# EAGLE schematic PMOD to BeagleWire - CR7CSZ (EAGLE 9.1.3)
LICENSE: CC BY-SA 4.0; REV: CR7CSZ; TITLE: PMOD to BeagleWire Adapter; URL: https://github.com/CapableRobot/PMOD-Adapters
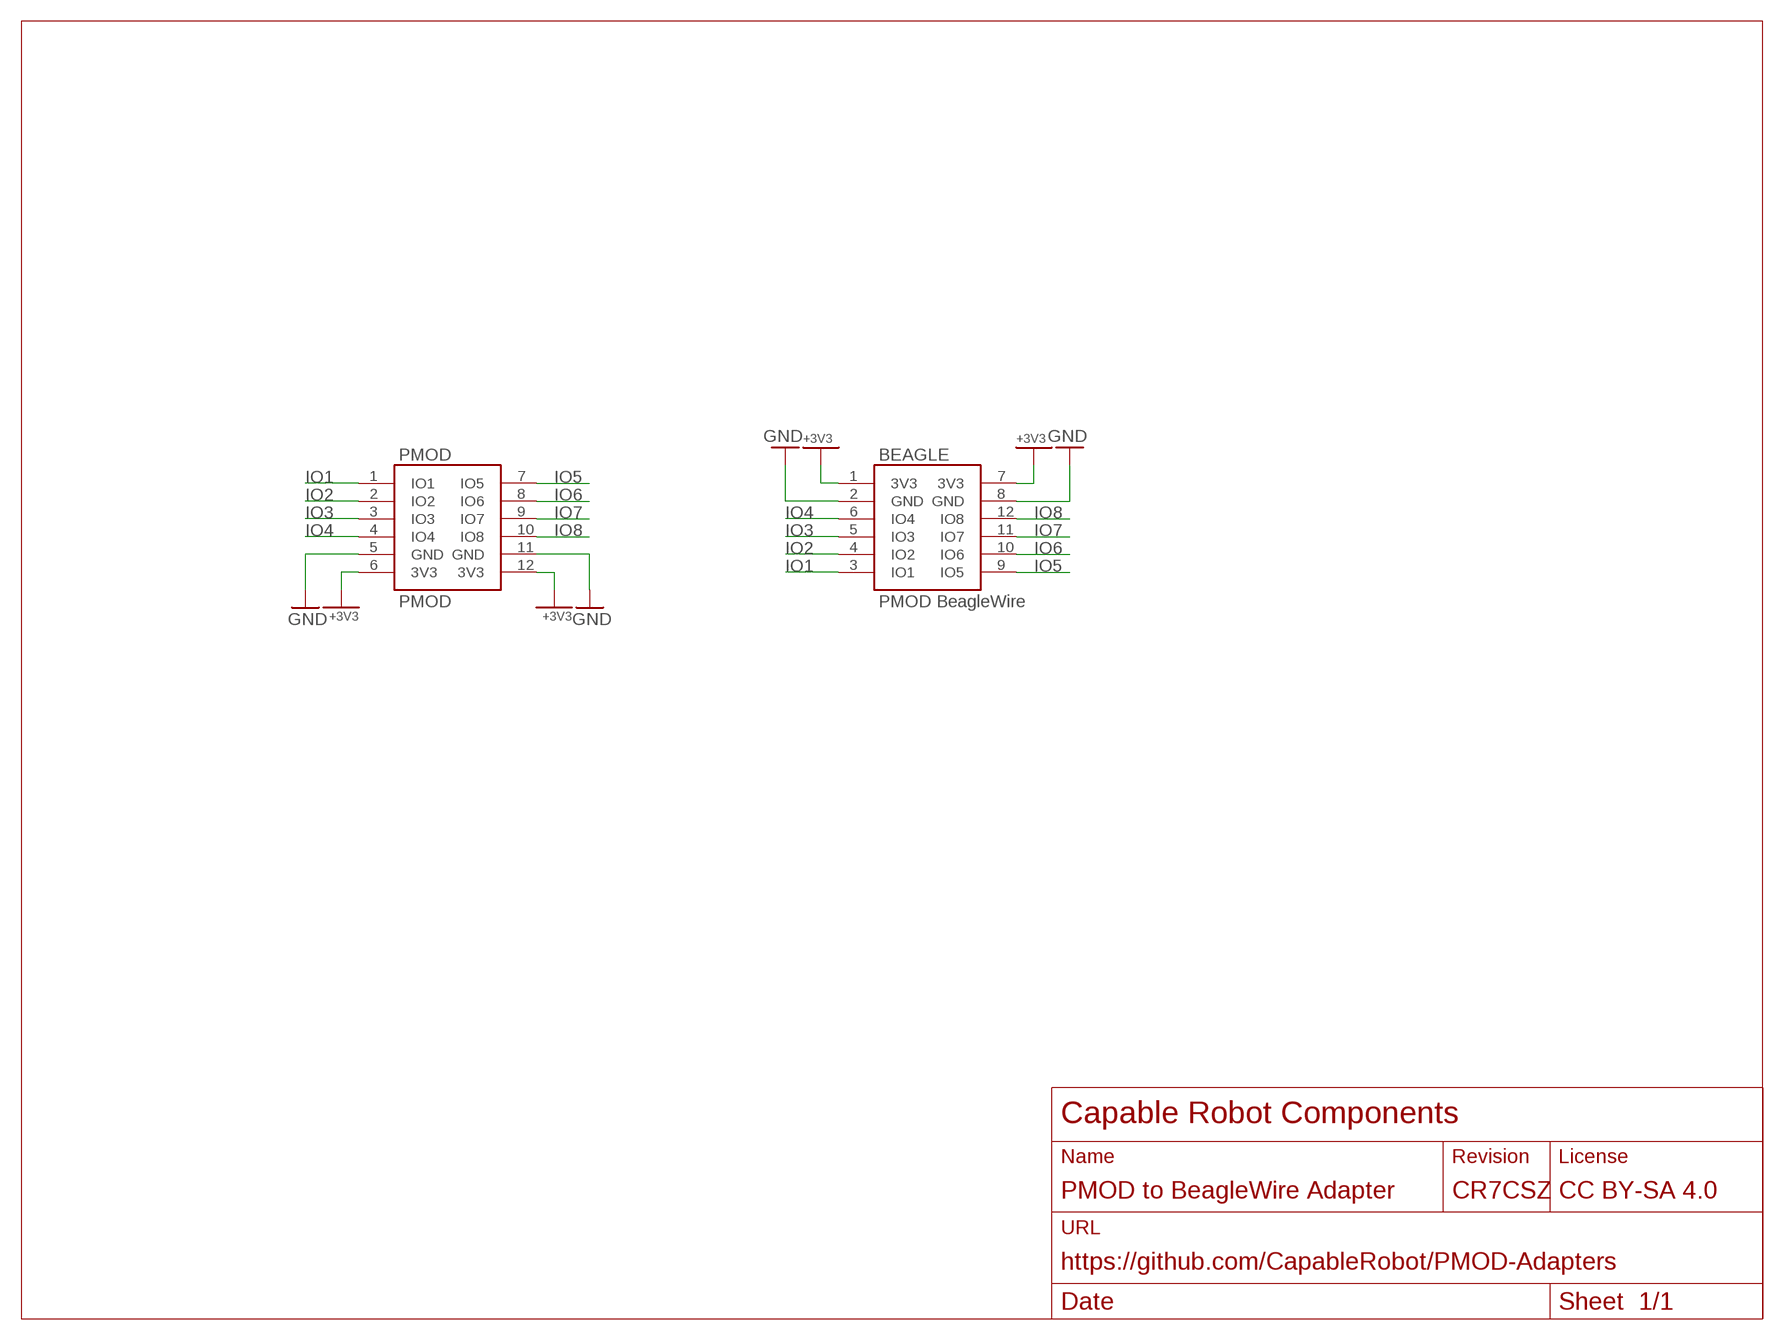
[diagram p0: schematic, sheet 1]

## Parts
BEAGLE  PMOD-BEAGLEWIRE  [HDRRA12W64P254_2X6_1524X254X556B]
PMOD  PMOD-HOST  [HDRRAR12W64P254_2X6_1524X736X556B]

## Nets
+3V3: BEAGLE.1(3V3) BEAGLE.7(3V3) PMOD.6(3V3) PMOD.12(3V3)
GND: BEAGLE.2(GND) BEAGLE.8(GND) PMOD.5(GND) PMOD.11(GND)
IO1: BEAGLE.3(IO1) PMOD.1(IO1)
IO2: BEAGLE.4(IO2) PMOD.2(IO2)
IO3: BEAGLE.5(IO3) PMOD.3(IO3)
IO4: BEAGLE.6(IO4) PMOD.4(IO4)
IO5: BEAGLE.9(IO5) PMOD.7(IO5)
IO6: BEAGLE.10(IO6) PMOD.8(IO6)
IO7: BEAGLE.11(IO7) PMOD.9(IO7)
IO8: BEAGLE.12(IO8) PMOD.10(IO8)

## Library data of the parts
BEAGLE = CapableRobot:PMOD-BEAGLEWIRE
PMOD = CapableRobot:PMOD